# Altium schematic sheet OutputChannel.SchDoc
size A4
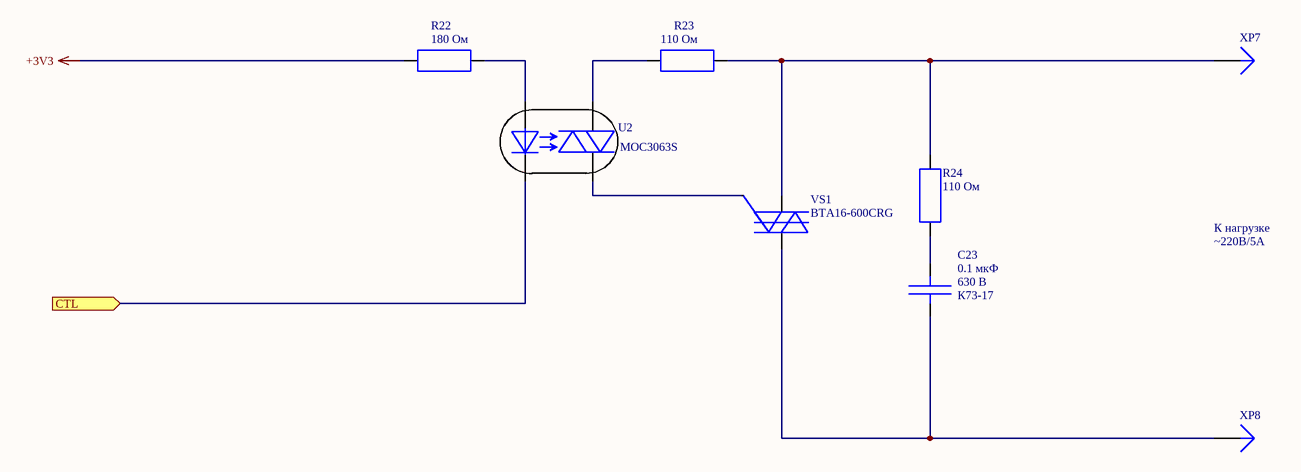
[diagram p0: OutputChannel.SchDoc]

## Parts
C23  value 0.1 мкФ  Voltage: 630 В  Type: К73-17  [B32652A6-7-12.5-18]  (hidden comment: Cap)
R22  value 180 Ом  [RES_0603-1608]  (hidden comment: Res)
R23  value 110 Ом  [RES_2512-6332]  (hidden comment: Res)
R24  value 110 Ом  [RES_2512-6332]  (hidden comment: Res)
U2  Type: MOC3063S  [SMD-2.54-6]  (hidden comment: OptoIso_Triac)
VS1  Type: BTA16-600CRG  [TO-220FP]  (hidden comment: Diode_TRIAC)
XP7  Plug  [EK508V_Pin]  (value not drawn)  (no BOM)
XP8  Plug  [EK508V_Pin]  (value not drawn)  (no BOM)

## Ports
CTL (in)

## Nets
+3V3: R22.2
CTL: U2.2(K1) ; port CTL
NetC23_1: C23.1 VS1.1(A) XP8.1
NetC23_2: C23.2 R24.2
NetR22_1: R22.1 U2.1(A1)
NetR23_1: R23.1 R24.1 VS1.2(K) XP7.1
NetR23_2: R23.2 U2.3(A2)
NetU2_4: U2.4(K2) VS1.3(G)

## Notes on the sheet
- К нагрузке
- ~220В/5А

## Library data of the parts
C23 = Cap: Конденсатор; BomGroup: Конденсаторы; BomTitle: Конденсатор металлоплёночный
R22 = Res: ЧИП резистор постоянный; Power: 0.1 W; Tolerance: 5%; BomGroup: Резисторы; BomTitle: Резистор SMD; Case: 0603
R23 R24 = Res: ЧИП резистор постоянный; Power: 2 W; Tolerance: 5%; BomGroup: Резисторы; BomTitle: Резистор SMD; Case: 2512; Type: CRM2512-JW-150ELF
U2 = OptoIso_Triac: Оптопара симисторная; pin to pad: 3>6; BomGroup: Оптоэлектронные приборы; BomTitle: Оптосимистор; Case: SMD-6
VS1 = Diode_TRIAC: Тиристор триодный симметричный двунаправленный; BomGroup: Диоды; BomTitle: Симистор; Case: TO-220FP
XP7 XP8 = Plug: LatestRevisionDate: 17-Jul-2002; LatestRevisionNote: Re-released for DXP Platform.; Publisher: Altium Limited